# EAGLE design Chameleon-Mini-RevE-2 (EAGLE 5.12)
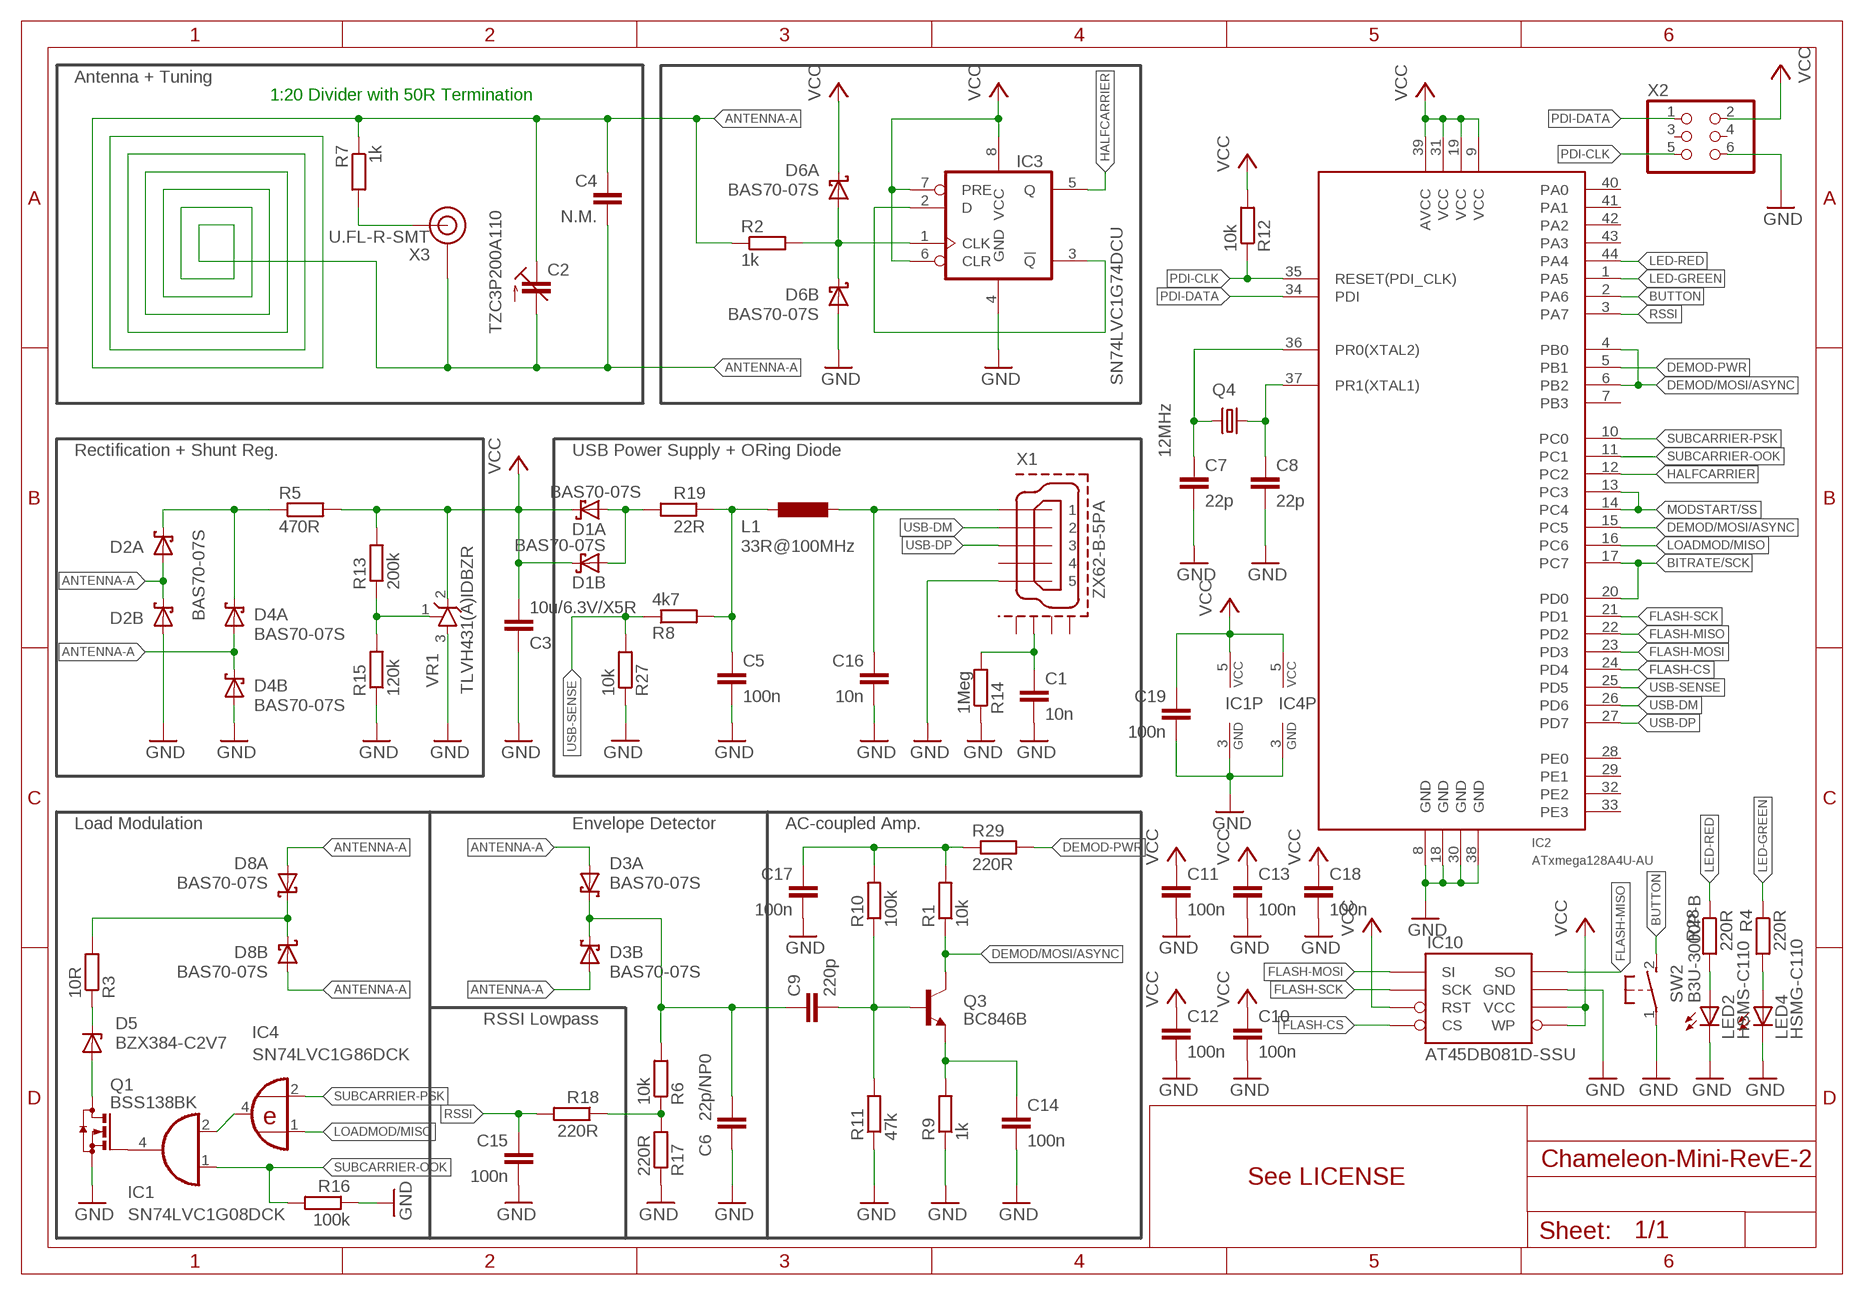
[diagram p0: schematic, sheet 1]

## Parts
C1  10n  C-EUC1206K  [C1206K]
C2  TZC3P200A110  TZC3P  [TZC3P]
C3  10u/6.3V/X5R  C-EUC1206K  [C1206K]
C4  N.M.  C-EUC1206  [C1206]
C5  100n  C-EUC1206K  [C1206K]
C6  22p/NP0  C-EUC0603K  [C0603K]
C7  22p  C-EUC0603K  [C0603K]
C8  22p  C-EUC0603K  [C0603K]
C9  220p  C-EUC0603K  [C0603K]
C10  100n  C-EUC0603K  [C0603K]
C11  100n  C-EUC0603K  [C0603K]
C12  100n  C-EUC0603K  [C0603K]
C13  100n  C-EUC0603K  [C0603K]
C14  100n  C-EUC0603K  [C0603K]
C15  100n  C-EUC0603K  [C0603K]
C16  10n  C-EUC1206K  [C1206K]
C17  100n  C-EUC0603K  [C0603K]
C18  100n  C-EUC0603K  [C0603K]
C19  100n  C-EUC0603K  [C0603K]
D1  BAS70-07S  [SOT363_PHILIPS]
D2  BAS70-07S  [SOT363_PHILIPS]
D3  BAS70-07S  [SOT363_PHILIPS]
D4  BAS70-07S  [SOT363_PHILIPS]
D5  BZX384-C2V7  BZX384  [SOD323]
D6  BAS70-07S  [SOT363_PHILIPS]
D8  BAS70-07S  [SOT363_PHILIPS]
IC1  SN74LVC1G08DCK  74LVC1G08DCK  [SC70-5]
IC2  ATxmega128A4U-AU  ATXMEGA_A4-A  [TQFP44]
IC3  SN74LVC1G74DCU  74LVC1G74DC  [VSSOP8]
IC4  SN74LVC1G86DCK  74AHC1G86DCK  [SC70-5]
IC10  AT45DB081D-SSU  AT45DB041B  [SO08]
L1  33R@100MHz  L-EUL2012C  [L2012C]
LED2  HSMS-C110  HSMX-C110  [HSMX-C110]
LED4  HSMG-C110  HSMX-C110  [HSMX-C110]
Q1  BSS138BK  BSS123  [SOT23]
Q3  BC846B  BC846BSMD  [SOT23]
Q4  12MHz  TXC7B  [5MMX3.2MM]
R1  10k  R-EU_R0603  [R0603]
R2  1k  R-EU_R0603  [R0603]
R3  10R  R-EU_R0603  [R0603]
R4  220R  R-EU_R0603  [R0603]
R5  470R  R-EU_R1206  [R1206]
R6  10k  R-EU_R0603  [R0603]
R7  1k  R-EU_R1206  [R1206]
R8  4k7  R-EU_R0603  [R0603]
R9  1k  R-EU_R0603  [R0603]
R10  100k  R-EU_R0603  [R0603]
R11  47k  R-EU_R0603  [R0603]
R12  10k  R-EU_R0603  [R0603]
R13  200k  R-EU_R0603  [R0603]
R14  1Meg  R-EU_R1206  [R1206]
R15  120k  R-EU_R0603  [R0603]
R16  100k  R-EU_R0603  [R0603]
R17  220R  R-EU_R0603  [R0603]
R18  220R  R-EU_R0603  [R0603]
R19  22R  R-EU_R1206  [R1206]
R27  10k  R-EU_R0603  [R0603]
R28  220R  R-EU_R0603  [R0603]
R29  220R  R-EU_R0603  [R0603]
SW2  B3U-3000P-B  [B3U-3000P-B]
VR1  TLVH431(A)IDBZR  TLVH431-SOT23  [SOT23]
X1  ZX62-B-5PA  ZX62-B-5PA-LONG  [ZX62-B-5PA-LONG]
X2  PINHD-2X3-2.54-EDGE  [PINHD-2X3-2.54-EDGE]
X3  U.FL-R-SMT  [U.FL-R-SMT]

## Nets
ANTENNA-A: C2.1(A) C2.2(E) C4.1 C4.2 D2.1(A:A) D2.3(B:C) D3.1(A:A) D3.4(B:A) D4.1(A:A) D4.3(B:C) D8.1(A:A) D8.4(B:A) R2.1 R7.1 X3.GND2(GND)
BITRATE/SCK: IC2.17(PC7) IC2.20(PD0)
BUTTON: IC2.2(PA6) SW2.2(S)
DEMOD-PWR: IC2.5(PB1) R29.2
DEMOD/MOSI/ASYNC: IC2.4(PB0) IC2.6(PB2) IC2.15(PC5) Q3.3(C) R1.1
FLASH-CS: IC2.24(PD4) IC10.4(CS)
FLASH-MISO: IC2.22(PD2) IC10.8(SO)
FLASH-MOSI: IC2.23(PD3) IC10.1(SI)
FLASH-SCK: IC2.21(PD1) IC10.2(SCK)
GND: C1.2 C3.1 C5.2 C6.2 C7.2 C8.2 C10.2 C11.2 C12.2 C13.2 C14.2 C15.2 C16.2 C17.2 C18.2 C19.2 D2.4(B:A) D4.4(B:A) D6.4(B:A) IC1.3(GND) IC2.8(GND) IC2.18(GND) IC2.30(GND) IC2.38(GND) IC3.4(GND) IC4.3(GND) IC10.7(GND) LED2.C LED4.C Q1.2(S) R9.1 R11.1 R14.1 R15.1 R16.1 R17.1 R27.1 SW2.1(P) VR1.3(A) X1.5 X2.6
HALFCARRIER: IC2.12(PC2) IC3.5(Q)
LED-GREEN: IC2.1(PA5) R4.1
LED-RED: IC2.44(PA4) R28.1
LOADMOD/MISO: IC2.16(PC6) IC4.1(I0)
MOD-DEMOD: D8.3(B:C) D8.6(A:C) R3.2
MOD-DEMOD1: C6.1 C9.1 D3.3(B:C) D3.6(A:C) R6.2
MODSTART/SS: IC2.13(PC3) IC2.14(PC4)
N$1: C14.1 Q3.2(E) R9.2
N$2: C5.1 L1.2 R8.2 R19.1
N$3: D5.2(A) Q1.3(D)
N$4: IC3.2(D) IC3.3(!Q)
N$5: C7.1 IC2.36(PR0(XTAL2)) Q4.3
N$6: R6.1 R17.2 R18.1
N$7: C16.1 L1.1 X1.1
N$8: C8.1 IC2.37(PR1(XTAL1)) Q4.1
N$9: LED2.A R28.2
N$10: D2.6(A:C) D4.6(A:C) R5.1
N$11: IC1.2(I1) IC4.4(O)
N$12: D5.1(C) R3.1
N$13: LED4.A R4.2
N$14: IC1.4(O) Q1.1(G)
N$15: R7.2 X3.SIG
N$56: C9.2 Q3.1(B) R10.1 R11.2
N$59: C1.1 R14.2 X1.P$2(GND2)
N$62: R13.1 R15.2 VR1.1(R)
N$66: D1.1(A:A) D1.4(B:A) R19.2
N$1234: D6.1(A:A) D6.3(B:C) IC3.1(CLK) R2.2
N$12345: C17.1 R1.2 R10.2 R29.1
PDI-CLK: IC2.35(RESET(PDI_CLK)) R12.1 X2.5
PDI-DATA: IC2.34(PDI) X2.1
RSSI: C15.1 IC2.3(PA7) R18.2
SUBCARRIER-OOK: IC1.1(I0) IC2.11(PC1) R16.2
SUBCARRIER-PSK: IC2.10(PC0) IC4.2(I1)
USB-DM: IC2.26(PD6) X1.2
USB-DP: IC2.27(PD7) X1.3
USB-SENSE: IC2.25(PD5) R8.1 R27.2
VCC: C3.2 C10.1 C11.1 C12.1 C13.1 C18.1 C19.1 D1.3(B:C) D1.6(A:C) D6.6(A:C) IC1.5(VCC) IC2.9(VCC) IC2.19(VCC) IC2.31(VCC) IC2.39(AVCC) IC3.6(CLR) IC3.7(PRE) IC3.8(VCC) IC4.5(VCC) IC10.3(RST) IC10.5(WP) IC10.6(VCC) R5.2 R12.2 R13.2 VR1.2(C) X2.2
Unconnected: IC2.7(PB3) IC2.28(PE0) IC2.29(PE1) IC2.32(PE2) IC2.33(PE3) IC2.40(PA0) IC2.41(PA1) IC2.42(PA2) IC2.43(PA3) X1.4 X1.P$1(GND1) X1.P$5(GND4) X1.P$6(GND3) X2.3 X2.4 X3.GND1(GND)

## Notes on the sheet
- Antenna + Tuning
- 1:20 Divider with 50R Termination
- Rectification + Shunt Reg. | USB Power Supply + ORing Diode
- Load Modulation | Envelope Detector | AC-coupled Amp.
- RSSI Lowpass
- See LICENSE

## Library data of the parts
C1 C3-C19 = rcl:C-EU: CAPACITOR, European symbol
C2 = Murata-TZC3P:TZC3P
D1-D4 D6 D8 = diode:BAS70-07: Silicon Schottky Diodes General-purpose diode for high-speed switching Source: BAS70_1PS7XSB70_SER_8.pdf
D5 = NXP-BZX384:BZX384
IC1 = 74xx-little-de:74*1G08: 2-input AND gate
IC2 = _ATxmega:ATXMEGA_A4
IC3 = 74LVC1G74:74LVC1G74
IC4 = 74xx-little-de:74*1G86: 2-input EXCLUSIV-OR gate
IC10 = SparkFun:AT45DB041B
L1 = rcl:L-EU: INDUCTOR, European symbol
LED2 LED4 = Avago-HSM:HSMX-C110
Q1 = transistor-small-signal:BSS123: N-CHANNEL MOS FET
Q3 = transistor-npn:BC846*: NPN Transistor
Q4 = TXC-Crystal:TXC7B
R1-R19 R27-R29 = rcl:R-EU_: RESISTOR, European symbol
SW2 = Omron-B3U:B3U-3000P
VR1 = TLVH431:TLVH431
X1 = Hirose-USB:ZX62-B-5PA
X2 = PINHD:PINHD-2X3
X3 = Hirose-UFL:U.FL-R-SMT

## Board
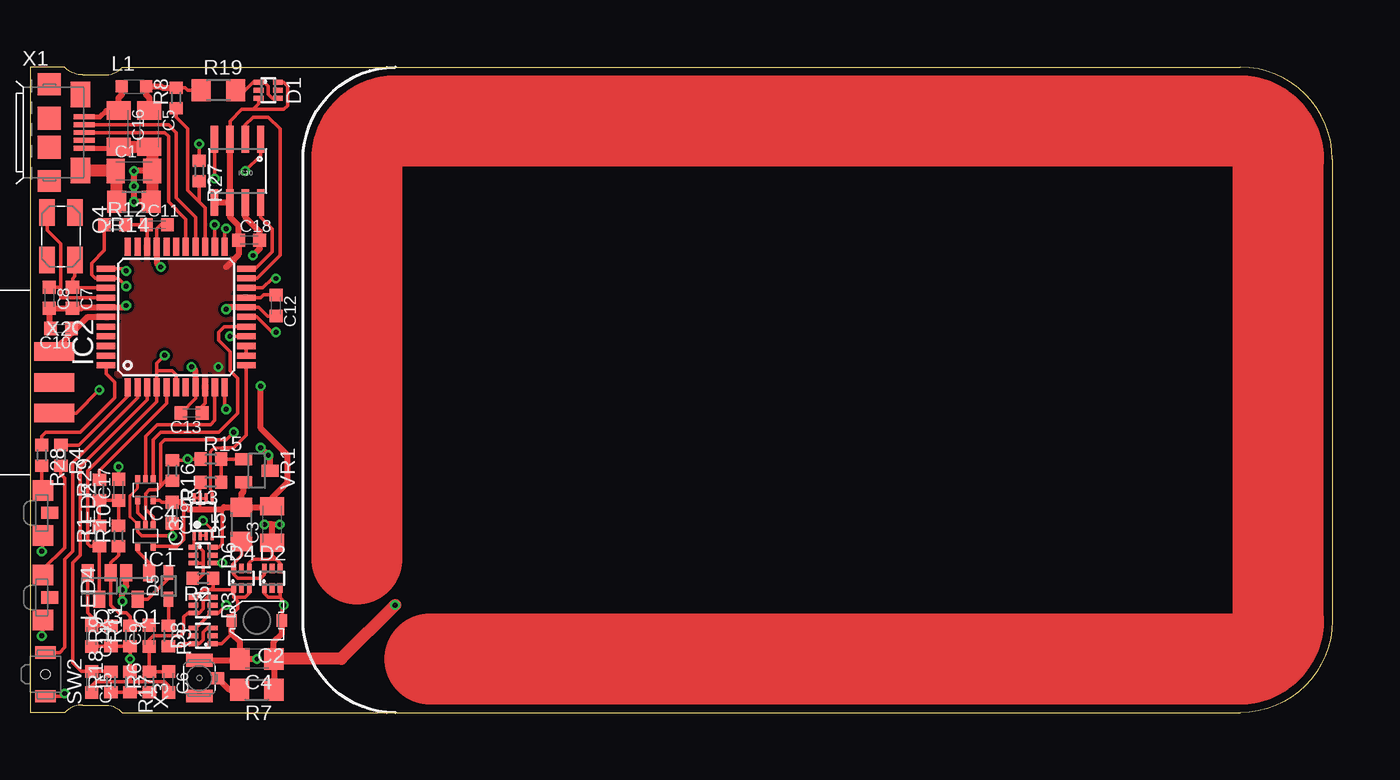
[diagram p1: board, top side]
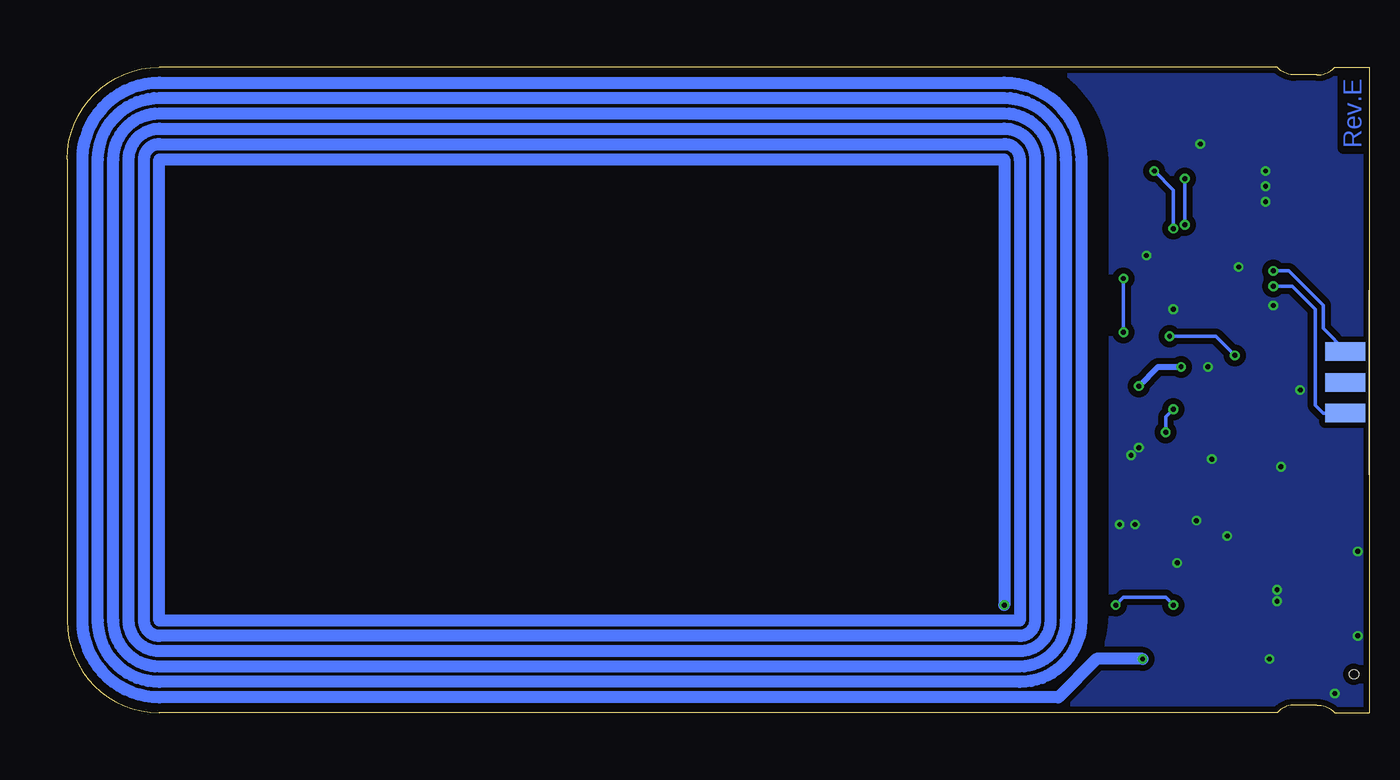
[diagram p2: board, bottom side, seen from below]

Size 107.63 x 53.34 mm. Coordinates in mm from the lower left corner, seen from the top.
Outline: 4.32,52.7 arc-45 2.91,53.29
Outline: 6.16,52.7 arc45 7.57,53.29
Outline: 4.32,52.7 arc-45 2.91,53.29
Outline: 2.91,53.29 2.86,53.34 0,53.34 0,0 2.86,0 2.91,0.05 arc-45 4.32,0.63 6.16,0.63 arc-45 7.57,0.05 7.62,0 100.01,0 arc90 107.63,7.62 107.63,45.72 arc90 100.01,53.34 7.62,53.34 7.57,53.29
Outline: 6.16,52.7 arc45 7.57,53.29
Outline: 4.32,52.7 6.16,52.7
Copper layers (1*16): Top 0.035mm / dielectric 1.5mm / Bottom 0.035mm
Design rules "mein *": minimum track width 0.2mm, minimum drill 0.4mm, track to track 0.18mm, track to pad 0.18mm, pad to pad 0.18mm, via to via 0.18mm, smd to smd 0mil, copper to edge 0.2mm, drill to drill 0.2mm, minimum pad ring 0.25mm, minimum via ring 0.2mm, stop-mask expansion 4mil, vias tented up to drill 0mil, thermal gap 0.5mm
Milling: 20 lines

### Footprints (pad centres in the part's own frame; a part is rotated, then mirrored left to right if it is on the bottom)
C1206K = smd 1.5 x 2: 1 -1.5,0; 2 1.5,0
TZC3P = smd 1 x 0.85: 1 0,2.075; 2 0,-2.075
C1206 = smd 1.6 x 1.8: 1 -1.4,0; 2 1.4,0
C0603K = smd 1.05 x 1.08: 1 -0.875,0; 2 0.875,0
SOT363_PHILIPS = smd 0.4 x 0.8: 1 -0.65,-0.8; 2 0,-0.8; 3 0.65,-0.8; 4 0.65,0.8; 5 0,0.8; 6 -0.65,0.8
SOD323 = smd 1.2 x 0.8: 1 -1.1,0; 2 1.1,0
SC70-5 = smd 0.4 x 0.7: 1 -0.65,-0.85; 2 0,-0.85; 3 0.65,-0.85; 4 0.65,0.85; 5 -0.65,0.85
TQFP44 = smd 1.5 x 0.5: 1 -5.8,4; 2 -5.8,3.2; 3 -5.8,2.4; 4 -5.8,1.6; 5 -5.8,0.8; 6 -5.8,0; 7 -5.8,-0.8; 8 -5.8,-1.6; 9 -5.8,-2.4; 10 -5.8,-3.2; 11 -5.8,-4; 23 5.8,-4; 24 5.8,-3.2; 25 5.8,-2.4; 26 5.8,-1.6; 27 5.8,-0.8; 28 5.8,0; 29 5.8,0.8; 30 5.8,1.6; 31 5.8,2.4; 32 5.8,3.2; 33 5.8,4 | smd 0.5 x 1.5: 12 -4,-5.8; 13 -3.2,-5.8; 14 -2.4,-5.8; 15 -1.6,-5.8; 16 -0.8,-5.8; 17 0,-5.8; 18 0.8,-5.8; 19 1.6,-5.8; 20 2.4,-5.8; 21 3.2,-5.8; 22 4,-5.8; 34 4,5.8; 35 3.2,5.8; 36 2.4,5.8; 37 1.6,5.8; 38 0.8,5.8; 39 0,5.8; 40 -0.8,5.8; 41 -1.6,5.8; 42 -2.4,5.8; 43 -3.2,5.8; 44 -4,5.8
VSSOP8 = smd 0.75 x 0.25: 1 -1.55,0.75; 2 -1.55,0.25; 3 -1.55,-0.25; 4 -1.55,-0.75; 5 1.55,-0.75; 6 1.55,-0.25; 7 1.55,0.25; 8 1.55,0.75
SO08 = smd 0.61 x 2.21: 1 -1.905,-2.616; 2 -0.635,-2.616; 3 0.635,-2.616; 4 1.905,-2.616; 5 1.905,2.616; 6 0.635,2.616; 7 -0.635,2.616; 8 -1.905,2.616
L2012C = smd 1 x 1: 1 -1,0; 2 1,0
HSMX-C110 = smd 1.7 x 1.7: A -1.85,0.1; C 1.85,0.1 | smd 1 x 1.4: P$3 0,0.65
SOT23 = smd 1 x 1.4: 1 -0.95,-1.1; 2 0.95,-1.1; 3 0,1.1
5MMX3.2MM = smd 2.2 x 1.3: 1 -1.95,-1.15; 2 1.95,-1.15; 3 1.95,1.15; 4 -1.95,1.15
R0603 = smd 1 x 1.1: 1 -0.85,0; 2 0.85,0
R1206 = smd 1.6 x 1.803: 1 -1.422,0; 2 1.422,0
B3U-3000P-B = smd 1 x 1.7: 1 -1.8,0; 2 1.8,0 | hole 0.75: 0,0
ZX62-B-5PA-LONG = smd 0.4 x 1.75: 1 -1.3,2.875; 2 -0.65,2.875; 3 0,2.875; 4 0.65,2.875; 5 1.3,2.875 | smd 2.1 x 1.6: P$1 -3.15,2.55; P$2 3.15,2.55 | smd 1.8 x 1.9: P$3 -4,0; P$4 4,0 | smd 1.9 x 1.9: P$5 -1.2,0; P$6 1.2,0
PINHD-2X3-2.54-EDGE = smd 3.302 x 1.524 bottom: 1 2,2.54; 3 2,0; 5 2,-2.54 | smd 3.302 x 1.524: 2 2,2.54; 4 2,0; 6 2,-2.54
U.FL-R-SMT = smd 1.05 x 2.2: GND1 -1.475,0; GND2 1.475,0 | smd 1 x 1.05: SIG 0,-1.525

### Placement (x,y rotation side)
C1  8.57,44.77 0 top
C2  18.73,7.62 90 top
C3  20,15.56 90 top
C4  18.73,4.45 180 top
C5  9.84,48.26 270 top
C6  11.43,2.54 270 top
C7  3.49,34.29 270 top
C8  1.59,34.29 270 top
C9  9.84,6.35 90 top
C10  2.54,31.75 180 top
C11  10.48,40.32 0 top
C12  20.32,33.66 270 top
C13  13.33,24.76 180 top
C14  5.08,6.35 270 top
C15  5.08,2.54 270 top
C16  7.3,48.26 270 top
C17  7.3,18.42 90 top
C18  18.1,39.05 0 top
C19  11.75,16.51 270 top
D1  19.68,51.44 270 top
D2  20,11.11 0 top
D3  14.29,8.89 270 top
D4  17.46,11.11 0 top
D5  11.43,10.48 90 top
D6  14.29,13.02 270 top
D8  14.29,6.35 90 top
IC1  9.53,14.61 180 top
IC2  12.07,32.7 90 top
IC3  14.29,16.19 90 top
IC4  9.53,18.42 180 top
IC10  17.14,44.77 180 top
L1  8.57,51.75 0 top
LED2  0.95,16.51 270 top
LED4  0.95,9.52 270 top
Q1  8.89,10.48 180 top
Q3  5.71,10.48 180 top
Q4  2.54,39.37 270 top
R1  5.71,14.61 90 top
R2  14.29,11.11 180 top
R3  11.43,6.35 270 top
R4  2.54,21.27 270 top
R5  17.46,15.56 90 top
R6  9.84,2.54 90 top
R7  18.73,1.9 180 top
R8  12.07,50.8 90 top
R9  6.67,6.35 90 top
R10  7.3,14.61 90 top
R11  8.25,6.35 90 top
R12  6.99,40.32 0 top
R13  14.92,19.05 180 top
R14  8.57,42.23 180 top
R15  14.92,20.96 0 top
R16  11.75,20 270 top
R17  8.25,2.54 270 top
R18  6.67,2.54 90 top
R19  15.56,51.44 0 top
R27  13.97,44.77 270 top
R28  0.95,21.27 270 top
R29  5.71,18.42 90 top
SW2  1.27,3.18 90 top
VR1  18.73,20 270 top
X1  1.59,47.94 270 top
X2  0,27.3 0 top
X3  13.97,2.86 90 top

### Tracks (layer width: path | path; a pad name or v marks a point on that pad's centre or on a via)
ANTENNA-A  (via drill 0.4)
  Top 0.3: D2.1 19.35,9.86 19.68,9.52 20.64,9.52 | D2.3 20.65,9.54 20.64,9.52 | D4.3 18.11,9.86 17.78,9.52 16.83,9.52 | 16.83,9.52 16.81,9.54 D4.1 16.66,10.16 14.92,10.16 | D3.1 13.67,9.54 14.29,10.16 14.92,10.16 | R2.1 15.14,10.38 14.92,10.16 | D8.4 13.67,7 14.91,8.24 D3.4 15.54,8.24 v16.19,8.89 | D8.1 15.84,5.7 16.66,6.52 | C2.1 16.66,8.09 17.14,8.57 17.14,9.21 16.83,9.52 | C2.2 20.81,8.89 | 20.81,8.89 20.81,9.36 20.64,9.52 | 20.81,8.89 v20.96,8.89
  Top 0.5: R7.1 20.15,4.42 C4.1 20.13,5.84 20.81,6.52 C2.2 | C4.2 17.33,5.84 16.66,6.52 C2.1 | C4.2 v18.73,4.45 | X3.GND2 17.22,4.33 C4.2
  Top 1: C4.1 25.72,4.45 v30.16,8.89
  Bottom 0.3: v20.96,8.89 20.32,9.52 16.83,9.52 v16.19,8.89
  Bottom 1: v30.16,8.89 30.16,45.72 100.01,45.72 100.01,7.62 28.89,7.62 28.89,45.72 arc-90 30.16,46.99 100.01,46.99 arc-90 101.28,45.72 101.28,7.62 arc-90 100.01,6.35 28.89,6.35 arc-90 27.62,7.62 27.62,45.72 arc-90 30.16,48.26 100.01,48.26 arc-90 102.55,45.72 102.55,7.62 arc-90 100.01,5.08 28.89,5.08 arc-90 26.35,7.62 26.35,45.72 arc-90 30.16,49.53 100.01,49.53 arc-90 103.82,45.72 103.82,7.62 arc-90 100.01,3.81 28.89,3.81 arc-90 25.08,7.62 25.08,45.72 arc-90 30.16,50.8 100.01,50.8 arc-90 105.09,45.72 105.09,7.62 arc-90 100.01,2.54 28.89,2.54 arc-90 23.81,7.62 23.81,45.72 arc-90 30.16,52.07 100.01,52.07 arc-90 106.36,45.72 106.36,7.62 arc-90 100.01,1.27 25.72,1.27 22.54,4.45 v18.73,4.45
BITRATE/SCK  (via drill 0.4)
  Top 0.3: IC2.17 18.73,32.7 20,31.43 v20.32,31.43 | v20.32,35.88 20,35.88 19.23,35.1 IC2.20
  Bottom 0.3: v20.32,31.43 v20.32,35.88
BUTTON
  Top 0.3: IC2.2 8.86,26.01 3.49,20.64 3.49,13.33 2.86,12.7 2.86,5.4 2.43,4.97 SW2.2
DEMOD-PWR
  Top 0.3: R29.2 5.71,20 11.26,25.55 IC2.5
DEMOD/MOSI/ASYNC  (via drill 0.4)
  Top 0.3: Q3.3 R1.1 4.98,13.75 4.76,13.97 4.76,20 10.46,25.71 IC2.4 10.46,28.26 | IC2.15 v16.52,31.1 v16.51,31.11 | 10.46,28.26 10.46,28.88 v11.11,29.53 | IC2.6 12.07,27.94 11.75,28.26 10.46,28.26
  Bottom 0.3: v16.51,31.11 12.7,31.11 v11.11,29.53
FLASH-CS  (via drill 0.4)
  Top 0.3: IC2.24 15.26,40.3 v15.24,40.32 | v15.24,44.13 IC10.4
  Bottom 0.3: v15.24,40.32 v15.24,44.13
FLASH-MISO
  Top 0.3: IC2.22 18.61,36.7 20,38.1 20,40 19.05,40.96 IC10.8
FLASH-MOSI  (via drill 0.4)
  Top 0.3: IC2.23 16.07,39.88 v16.19,40 | v17.78,44.77 19.05,46.04 IC10.1
  Bottom 0.3: v16.19,40 16.19,43.18 v17.78,44.77
FLASH-SCK
  Top 0.3: IC2.21 18.76,35.9 20.64,37.78 20.64,48.26 19.68,49.21 18.42,49.21 17.78,48.58 IC10.2
GND  (via drill 0.4)
  Top 0.25: D6.4 15.89,12.37 v15.88,12.38 | 8.88,15.57 8.25,16.19 8.25,17.94 8.88,18.56 IC4.3 | IC3.4 15.04,15.12 v14.29,15.87
  Top 0.3: X2.6 3.81,24.76 v5.71,26.67 | D2.4 20.65,12.37 20.32,12.7 | D4.4 18.11,12.4 18.42,12.7 20.32,12.7 | C3.1 20,13.02 20.32,12.7 | C15.2 5.08,2.22 5.4,2.54 8.25,2.54 | C6.2 11.43,2.22 11.11,2.54 8.25,2.54 | 8.25,2.54 R17.1 v8.25,4.45 R11.1 R9.1 6.64,5.47 C14.2 | IC2.18 18.89,33.5 19.61,32.78 C12.2 | C17.2 v7.3,20.32 | IC2.30 10.46,39.99 10.79,40.32 C11.2 | 8.88,15.57 IC1.3 8.88,14.94 9.21,14.61 v11.75,14.61 C19.2 | SW2.1 2.64,1.38 v2.86,1.59 | IC2.8 13.67,25.97 C13.2 | R16.1 12.92,20.85 v13.02,20.96 R15.1 | R27.1 v13.97,46.99 | LED2.C 1.05,13.43 v0.95,13.33 | LED4.C 1.05,6.45 v0.95,6.35
  Top 0.4: X1.5 7.18,46.64 C16.2
  Top 0.5: 10.07,42.3 R14.1 v8.57,42.23 v8.57,43.5 v8.57,44.77 C1.2 | C5.2 10.07,46.53 | v7.94,33.66 7.78,33.5 IC2.38 4.29,33.5 4.21,33.42 C7.2 C8.2 1.59,31.83 C10.2 | IC2.8 13.67,28.25 v13.33,28.57 | IC2.18 16.36,33.5 v16.19,33.34 | IC2.30 10.46,37.16 v10.79,36.83 | C3.1 20,15.56 | 20,15.56 v19.37,15.56 | 20,15.56 v20.64,15.56 | Q1.2 7.94,10.48 v7.62,10.16 v7.62,9.21 | VR1.3 19.83,21.12 v19.68,21.27 v19.05,21.91 | IC10.7 17.78,40.96 18.97,39.77 C18.2 18.97,38.34 v18.42,37.78
  Top 1: C16.2 C5.2 | 10.07,42.3 C1.2 10.07,46.53
  pour Bottom (isolate 0.5): 30.8,54.61 3.18,54.61 3.18,55.25 0,55.25 0,-1.91 3.18,-1.91 3.18,-1.27 30.8,-1.27 arc-90 21.27,8.25 21.27,45.72 arc-90
HALFCARRIER
  Top 0.25: IC3.5 15.04,18.3 14.92,18.42 14.92,21.59 15.24,21.91 15.88,21.91
  Top 0.3: IC2.12 17.86,22.94 16.83,21.91 15.88,21.91
LED-GREEN
  Top 0.3: IC2.1 8.07,26.16 4.03,22.12 R4.1
LED-RED
  Top 0.3: IC2.44 6.26,28.03 6.99,27.3 6.99,26.04 4.13,23.18 1.27,23.18 0.95,22.86 R28.1
LOADMOD/MISO
  Top 0.3: IC4.1 10.18,22.56 10.79,23.18 15.56,23.18 17.14,24.76 17.14,27.62 16.51,28.26 16.51,29.85 15.56,30.8 15.56,31.43 16.03,31.9 IC2.16
MOD-DEMOD
  Top 0.3: D8.3 14.62,7 14.29,6.67 14.29,6.03 13.96,5.7 D8.6 12.68,5.7 12.49,5.5 R3.2
MOD-DEMOD1
  Top 0.3: C6.1 11.4,3.39 R6.2 C9.1 9.84,6.03 10.16,6.35 12.38,6.35 12.7,6.67 12.7,7.94 13,8.24 D3.3 13.96,8.24 14.29,8.57 14.29,9.21 14.62,9.54 D3.6
MODSTART/SS
  Top 0.3: IC2.13 IC2.14
N$1
  Top 0.3: R9.2 5.11,7.2 C14.1 5.08,7.94 4.76,8.25 Q3.2
N$2
  Top 0.3: R19.1 13.02,51.44 12.8,51.65 R8.2
  Top 0.5: C5.1 9.84,50.8 9.57,51.07 L1.2 10.79,51.75 10.9,51.65 R8.2
N$3
  Top 0.3: D5.2 11.43,11.11 9.69,9.38 Q1.3
N$4
  Top 0.25: IC3.3 IC3.2
N$5
  Top 0.3: Q4.3 3.69,36.08 3.49,35.88 C7.1 3.56,35.1 IC2.36
N$6
  Top 0.3: R18.1 R17.2 R6.1
N$7
  Top 0.4: X1.1 5.75,49.24 6.26,49.76 C16.1
  Top 0.5: L1.1 7.57,51.07 7.3,50.8 C16.1
N$8
  Top 0.3: 2.54,35.24 2.54,38.73 1.39,39.89 Q4.1 | C8.1 2.46,35.17 2.54,35.24 | IC2.37 2.54,34.3 2.54,35.24
N$9
  Top 0.3: R28.2 0.95,18.46 LED2.A
N$10
  Top 0.3: R5.1 17.46,13.02 16.81,12.37 D4.6 16.81,11.45 17.14,11.11 19.05,11.11 19.35,11.41 D2.6
N$11
  Top 0.3: IC4.4 8.88,16.53 9.53,15.87 IC1.2
N$12
  Top 0.3: R3.1 D5.1
N$13
  Top 0.3: R4.2 2.54,19.68 2.86,19.37 2.86,13.65 1.05,11.85 LED4.A
N$14
  Top 0.3: IC1.4 8.88,13.35 9.84,12.38 Q1.1
N$15
  Top 0.5: R7.2 16.45,1.9 X3.SIG
N$16
  Top 7.5: 26.99,12.7 26.99,45.72 arc-90 30.16,48.89 100.01,48.89 arc-90 103.19,45.72 103.19,7.62 arc-90 100.01,4.45 33.02,4.45
N$56
  Top 0.3: C9.2 8.28,7.22 R11.2 8.25,7.94 7.94,8.25 7.3,8.25 6.67,8.89 Q3.1 6.67,12.38 7.3,13.02 R10.1
N$59
  Top 0.5: 7.15,44.69 C1.1 | 4.16,44.77 X1.P$2
  Top 1: R14.2 7.15,44.69 | C1.1 4.16,44.77
N$62
  Top 0.3: R13.1 R15.2 16.51,20.96 16.51,20.95 VR1.1
N$66
  Top 0.3: R19.2 17.78,51.44 18.43,52.09 D1.1 19.35,52.09 19.68,51.75 19.68,51.12 20.02,50.78 D1.4
N$1234
  Top 0.25: IC3.1 13.54,13.72 D6.1
  Top 0.3: R2.2 13.97,11.11 14.29,11.43 14.29,12.38 | D6.3 14.27,12.37 14.29,12.38 | D6.1 13.96,13.67 14.29,13.33 14.29,12.38
N$12345
  Top 0.3: R10.2 C17.1 7.28,17.57 R29.1 R1.2
PDI-CLK  (via drill 0.4)
  Top 0.3: v7.94,35.24 7.28,35.9 IC2.35 5.37,35.9 5.08,36.19 5.08,37.15 6.14,38.2 R12.1
  Bottom 0.3: X2.5 3.81,24.76 4.44,25.4 4.44,33.34 6.35,35.24 v7.94,35.24
PDI-DATA  (via drill 0.4)
  Top 0.3: IC2.34 7.75,36.7 v7.94,36.51
  Bottom 0.3: X2.1 1.91,29.85 3.81,31.75 3.81,33.66 6.67,36.51 v7.94,36.51
RSSI
  Top 0.3: IC2.3 9.67,25.86 4.13,20.32 4.13,13.02 3.49,12.38 3.49,4.13 4.21,3.41 C15.1 6.64,3.41 R18.2
SUBCARRIER-OOK  (via drill 0.4)
  Top 0.3: IC1.1 10.18,16.18 9.53,16.83 9.53,18.1 9.84,18.42 10.48,18.42 10.79,18.73 | 10.79,18.73 10.79,22.22 11.11,22.54 16.19,22.54 v16.83,23.18 | IC2.11 16.07,25.21 v16.19,25.08 | R16.2 11.21,19.15 10.79,18.73
  Bottom 0.3: v16.83,23.18 16.83,24.45 v16.19,25.08
SUBCARRIER-PSK
  Top 0.3: IC2.10 15.26,24.15 14.92,23.81 10.48,23.81 9.53,22.86 IC4.2
USB-DM
  Top 0.3: IC2.26 13.67,40.94 12.07,42.55 12.07,47.94 11.43,48.58 4.48,48.58 X1.2
USB-DP
  Top 0.3: IC2.27 12.86,40.79 11.43,42.23 11.43,47.62 11.11,47.94 X1.3
USB-SENSE
  Top 0.3: IC2.25 14.46,41.73 13.97,42.23 | 13.97,42.23 13.02,43.18 13.02,48.26 12.07,49.21 R8.1 | 13.97,42.23 R27.2
VCC  (via drill 0.4)
  Top 0.25: IC3.7 IC3.6 | IC3.7 IC3.8 | IC3.7 14.04,16.89 13.97,16.83 | IC3.7 14.04,19.01 R13.2
  Top 0.3: R12.2 C11.1 9.67,40.26 IC2.31 | D1.6 20.94,52.09 21.27,51.75 21.27,50.17 20.96,49.85 18.42,49.85 | D1.3 18.89,50.32 18.42,49.85 | IC2.19 19.06,34.3 19.29,34.53 C12.1 | IC1.5 12.17,13.75 12.7,14.29 12.7,17.14 | IC4.5 10.69,17.57 10.87,17.39 C19.1 | D6.6 15.57,13.67 15.88,13.97 15.88,16.83 | IC2.9 14.46,25.58 14.21,25.32 C13.1 | IC10.3 16.51,48.89 17.46,49.85 18.42,49.85
  Top 0.5: IC2.39 4.76,32.7 3.81,31.75 C10.1 3.42,31.36 2,29.94 X2.2 | R5.2 19.92,16.98 C3.2 20,17.78 21.27,19.05 21.27,21.27 19.05,23.5 v19.05,26.99 | VR1.2 17.63,18.27 17.46,18.1 R5.2 | C19.1 12.46,17.39 12.7,17.14 13.02,16.83 13.97,16.83 15.88,16.83 16.03,16.98 R5.2 | 16.19,36.83 17.22,37.86 C18.1 17.22,40.25 16.51,40.96 IC10.6 | IC10.6 IC10.5 | IC10.6 IC10.3
  Bottom 0.5: v19.05,26.99 17.46,28.57 v15.56,28.57
  pour Top (isolate 0.25): 15.88,38.42 8.25,38.42 6.35,36.51 6.35,28.26 7.62,26.99 15.88,26.99 17.78,28.89 17.78,36.51

### Text on the board
Bottom: Rev.E